# Altium schematic sheet projet_pcb_nucleo_g431.SchDoc
size A2
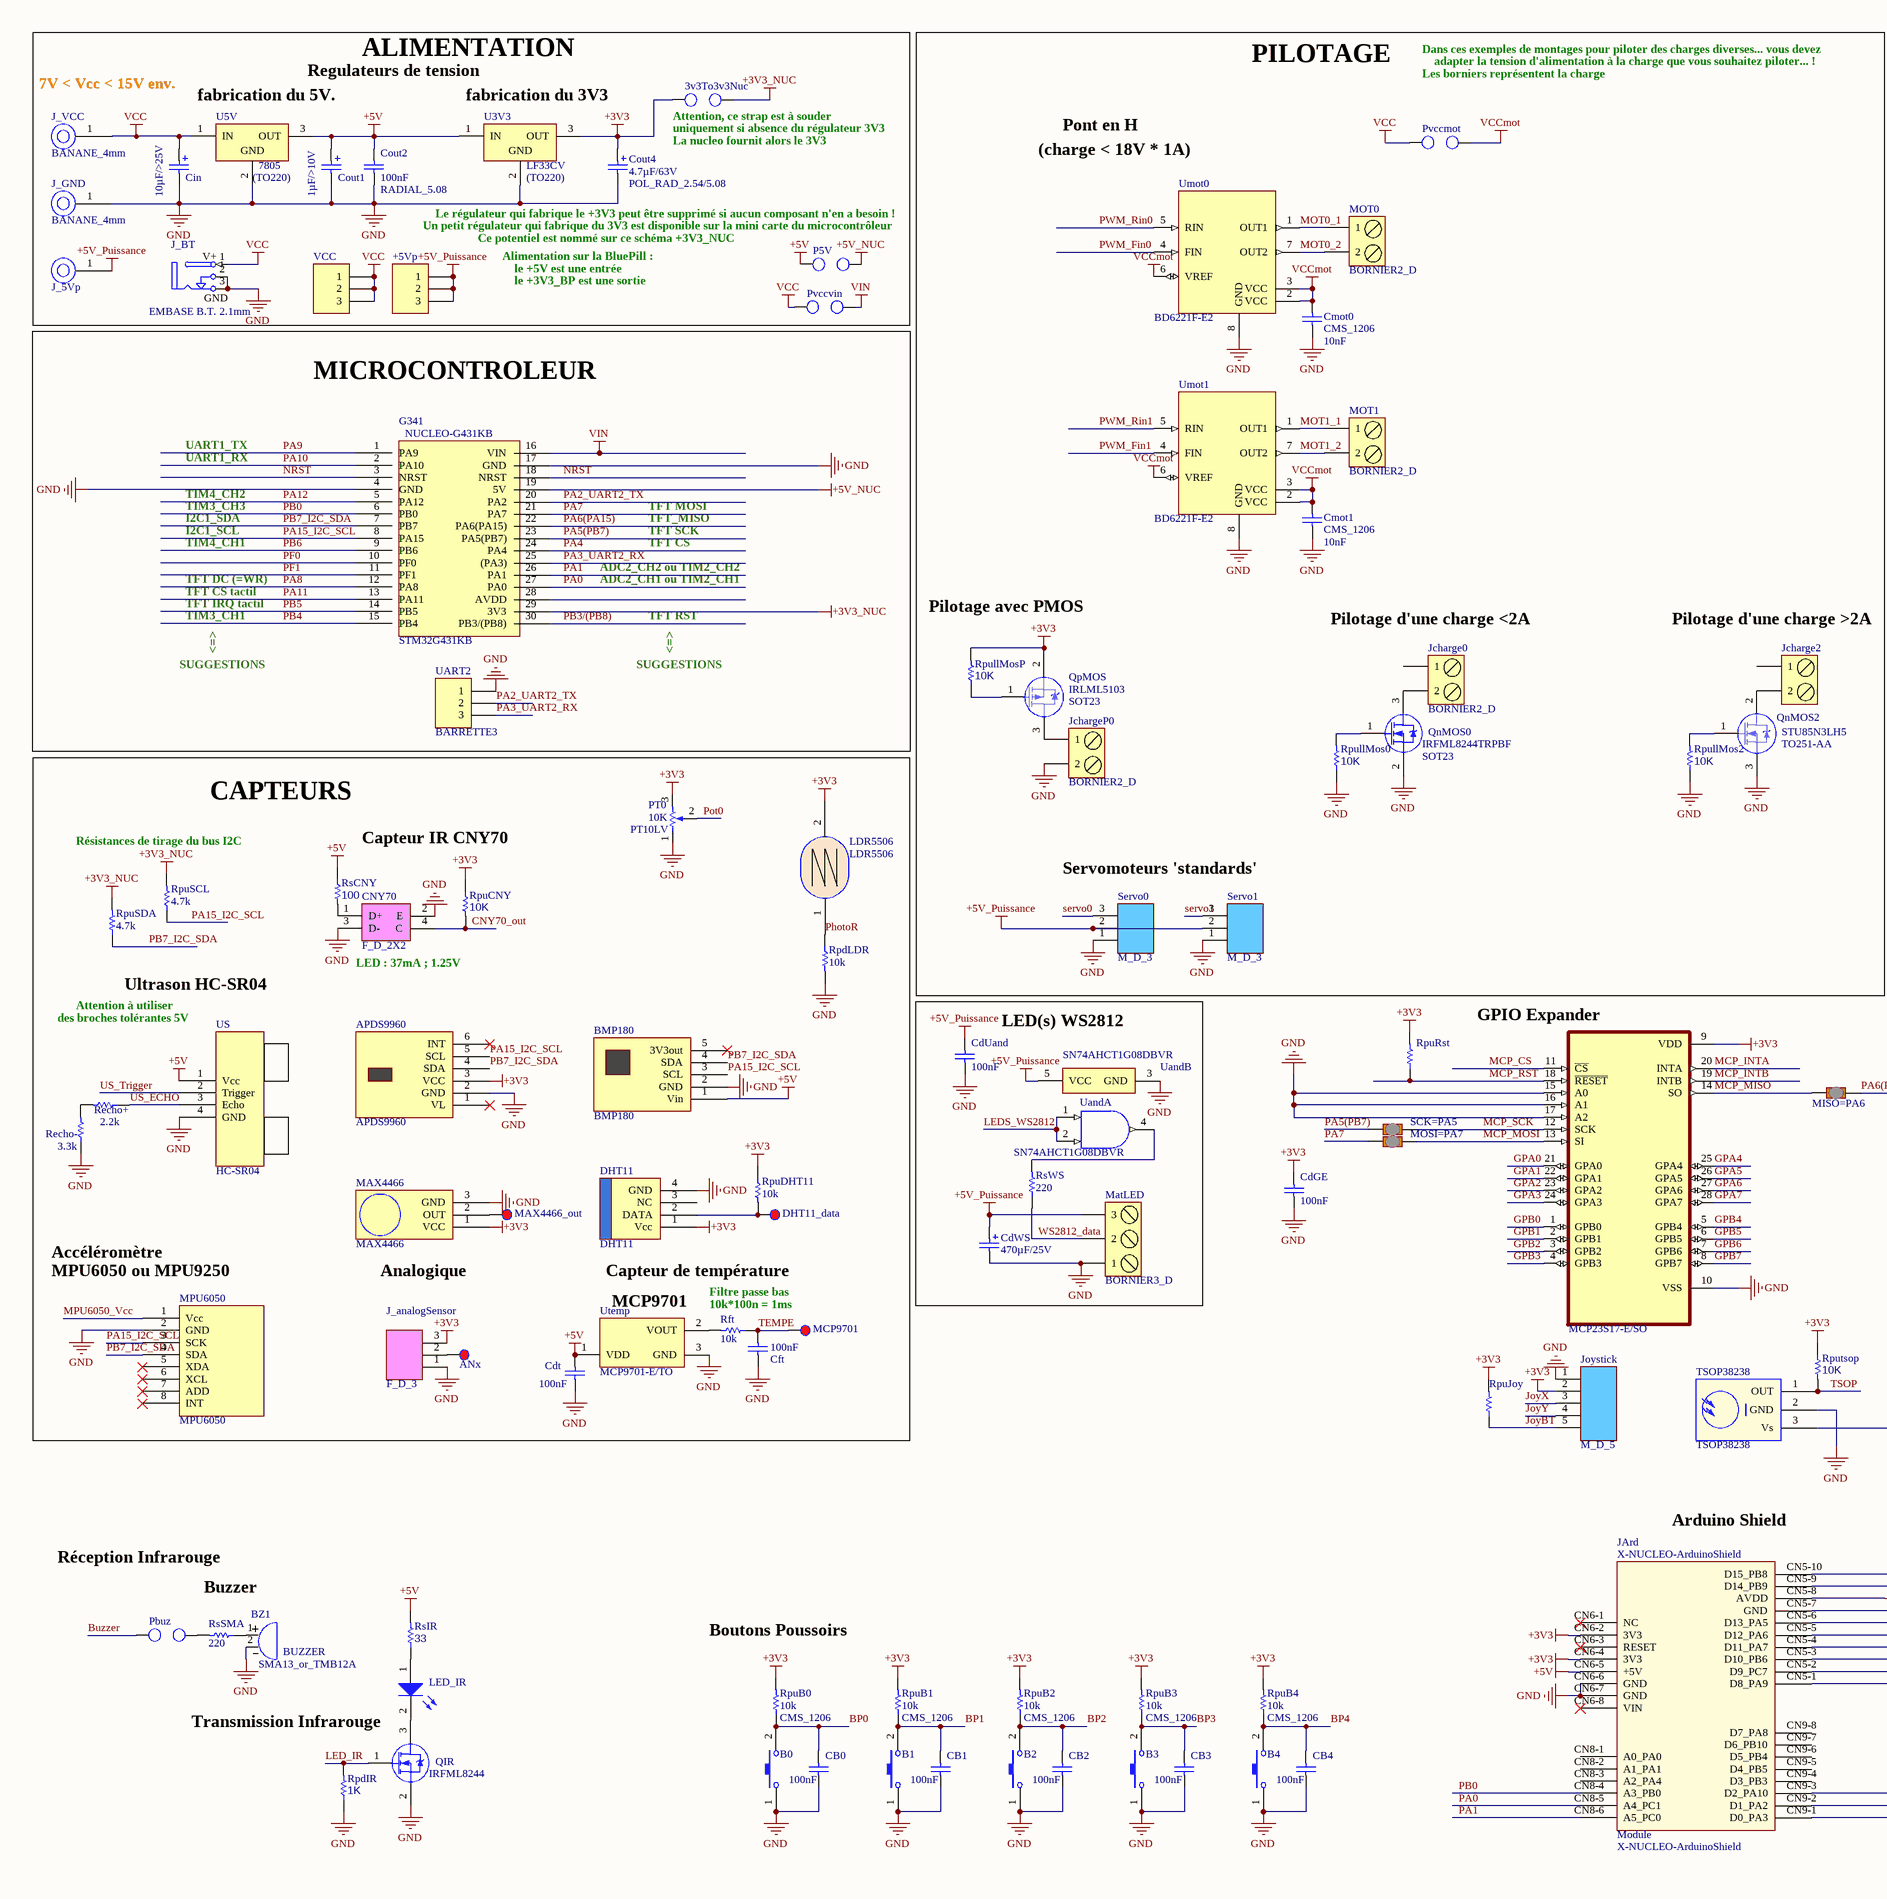
[diagram p0: projet_pcb_nucleo_g431.SchDoc, left]
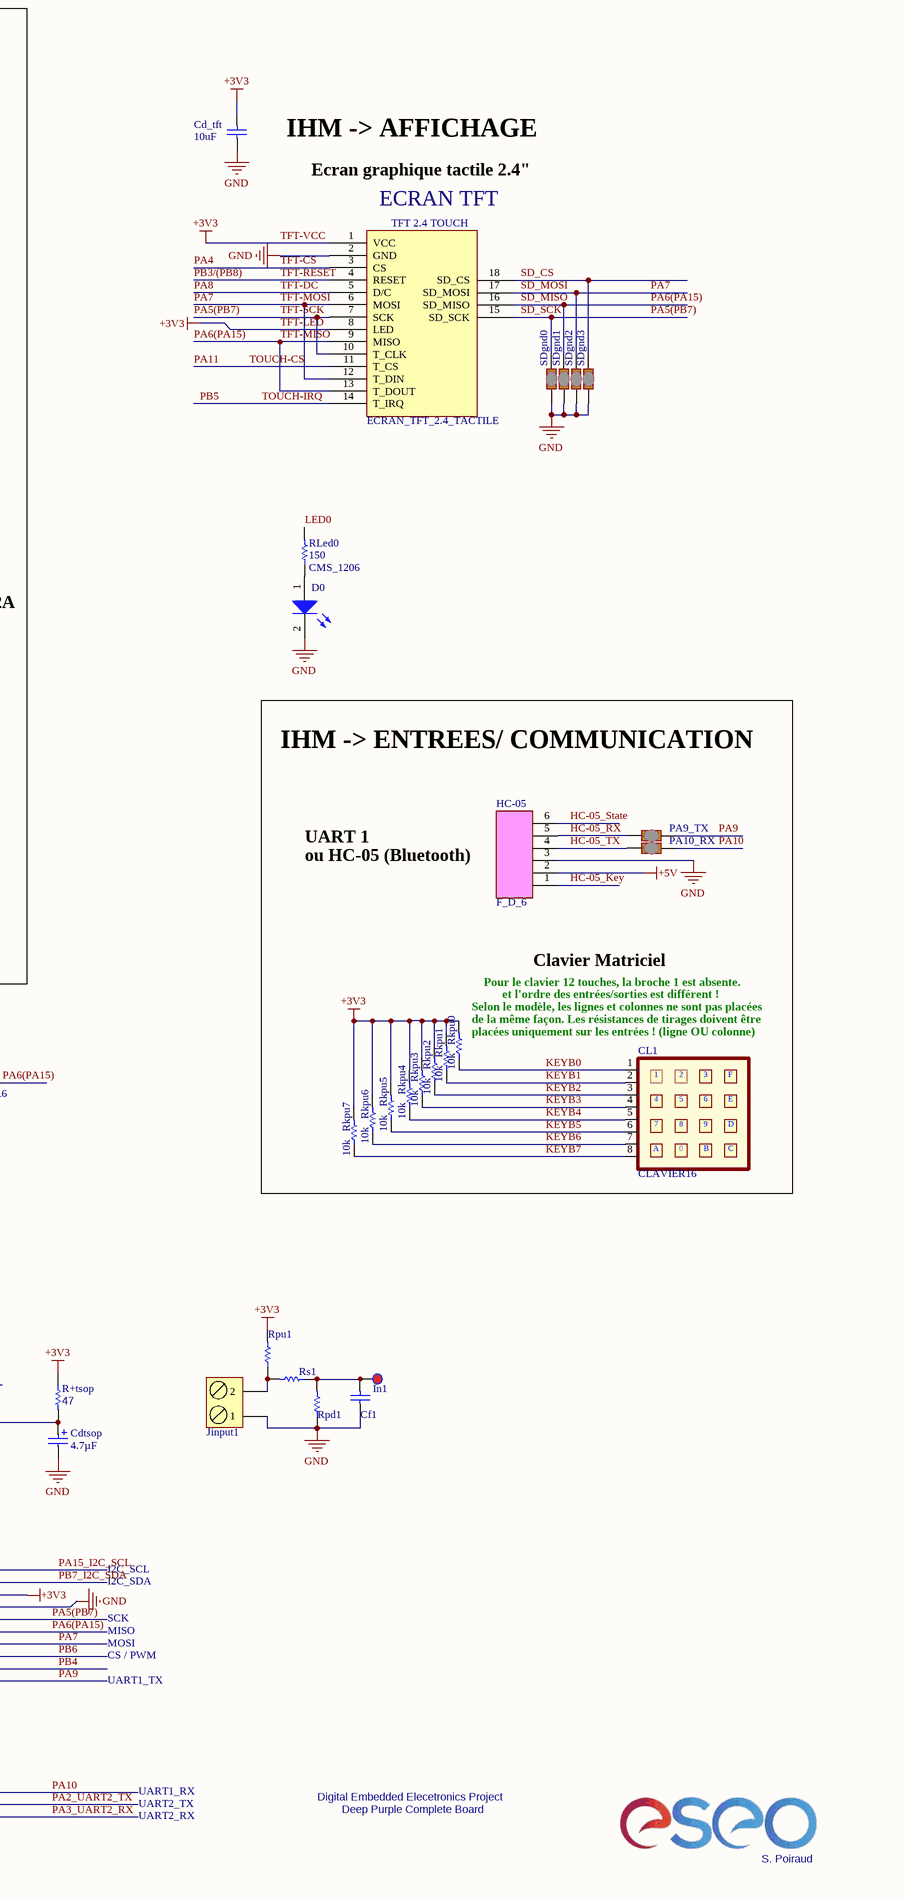
[diagram p1: projet_pcb_nucleo_g431.SchDoc, right]

## Parts
3v3To3v3Nuc  JUMPER2  [BARRETTE_2_M_D]  (value not drawn)
+5Vp  BARRETTE3  [HDR1X3]  (value not drawn)
?  MCP23S17-E/SO  [SOIC127P1030X265-28N]
ANx  Name  [Point_Fil]  (value not drawn)
APDS9960  APDS9960  [APDS9960]
B0  BOUTON_POUSSOIR_MINIATURE_TRAVERSANT  [BOUTON_POUSSE_PLAT_6x6]  (value not drawn)
B1  BOUTON_POUSSOIR_MINIATURE_TRAVERSANT  [BOUTON_POUSSE_PLAT_6x6]  (value not drawn)
B2  BOUTON_POUSSOIR_MINIATURE_TRAVERSANT  [BOUTON_POUSSE_PLAT_6x6]  (value not drawn)
B3  BOUTON_POUSSOIR_MINIATURE_TRAVERSANT  [BOUTON_POUSSE_PLAT_6x6]  (value not drawn)
B4  BOUTON_POUSSOIR_MINIATURE_TRAVERSANT  [BOUTON_POUSSE_PLAT_6x6]  (value not drawn)
BMP180  BMP180  [BMP180]
BZ1  value SMA13_or_TMB12A  Type: BUZZER  [BUZZER_SMA13  or TMB12A]  (hidden comment: BUZZER_SMA13)
CB0  value 100nF  [C0805_N]  (hidden comment: Condensateur 0805)
CB1  value 100nF  [C0805_N]  (hidden comment: Condensateur 0805)
CB2  value 100nF  [C0805_N]  (hidden comment: Condensateur 0805)
CB3  value 100nF  [C0805_N]  (hidden comment: Condensateur 0805)
CB4  value 100nF  [C0805_N]  (hidden comment: Condensateur 0805)
Cd_tft  10uF  [C0805_N]
CdGE  value 100nF  [C0805_N]  (hidden comment: CONDENSATEUR_CER_RAD_5.08)
Cdt  value 100nF  [C0805_N]  (hidden comment: Condensateur CMS 0805)
Cdtsop  value 4.7µF  [CONDENSATEUR_POLARISE_ELECTROLYTIQUE_RADIAL_2.0/5.08]  (hidden comment: CONDENSATEUR_POL_ELECTROLY_RAD_2.0/5.08)
CdUand  value 100nF  [C0805_N]  (hidden comment: CONDENSATEUR_CER_RAD_5.08)
CdWS  value 470µF/25V  [CONDENSATEUR_POLARISE_ELECTROLYTIQUE_RADIAL_5.08/10.16]  (hidden comment: CONDENSATEUR_POL_ELECTROLY_RAD_5.08/10.16)
Cf1  Condensateur 0805  [C0805_N]  (value not drawn)
Cft  value 100nF  [C0805_N]  (hidden comment: Condensateur CMS 0805)
Cin  value 10µF/>25V  [CONDENSATEUR_POLARISE_ELECTROLYTIQUE_RADIAL_2.0/5.08]  (hidden comment: CONDENSATEUR_POL_ELECTROLY_RAD_2.0/5.08)
CL1  Type: CLAVIER16  [CLAVIER_16_TOUCHES]  (hidden comment: CLAVIER_16_TOUCHES)
Cmot0  value 10nF  [CONDENSATEUR_CMS_1206]  (hidden comment: CMS_1206)
Cmot1  value 10nF  [CONDENSATEUR_CMS_1206]  (hidden comment: CMS_1206)
CNY70  Type: F_D_2X2  [BARRETTE_2X2_F_D]  (hidden comment: BARRETTE 2 CONTACTS 2 RANGEES FEMELLE DROITE)
Cout1  value 1µF/>10V  [CONDENSATEUR_POLARISE_ELECTROLYTIQUE_RADIAL_2.0/5.08]  (hidden comment: CONDENSATEUR_POL_ELECTROLY_RAD_2.0/5.08)
Cout2  value 100nF  Type: RADIAL_5.08  [CONDENSATEUR_CERAMIQUE_RADIAL_5.08]  (hidden comment: CONDENSATEUR_CER_RAD_5.08)
Cout4  value 4.7µF/63V  Type: POL_RAD_2.54/5.08  [CONDENSATEUR_POLARISE_ELECTROLYTIQUE_RADIAL_2.54/5.08]  (hidden comment: CONDENSATEUR_POL_ELECTROLY_RAD_2.54/5.08)
D  Type: LED_IR  [LED_5MM]  (hidden comment: LED_3MM)
D0  LED_3MM  [LED_3MM]  (value not drawn)
DHT11  DHT11  [DHT11]
DHT11_data  Name  [Point_Fil]  (value not drawn)
G341  STM32G431KB  [NUCLEO-G431KB]
HC-05  Type: F_D_6  [BARRETTE_6_F_D]  (hidden comment: BARRETTE_6 CONTACTS_1 RANGEE_FEMELLE_DROITE)
In1  Name  [Point_Fil]  (value not drawn)
J_5Vp  DOUILLE BANANE 4mm  [DOUILLE_BANANE_4mm]  (value not drawn)
J_analogSensor  Type: F_D_3  [BARRETTE_3_F_D]  (hidden comment: BARRETTE 3 CONTACTS 1 RANGEE FEMELLE DROITE)
J_BT  Type: EMBASE B.T. 2.1mm  [EMBASE_BASSE_TENSION_2.1mm]  (hidden comment: EMBASE_BASSE_TENSION_2.1mm)
J_GND  Type: BANANE_4mm  [DOUILLE_BANANE_4mm]  (hidden comment: DOUILLE BANANE 4mm)
J_VCC  Type: BANANE_4mm  [DOUILLE_BANANE_4mm]  (hidden comment: DOUILLE BANANE 4mm)
JArd  X-NUCLEO-ArduinoShield  [X-NUCLEO-ARDUINO_SHIELD]
Jcharge0  Type: BORNIER2_D  [BORNIER2_A_VIS]  (hidden comment: BORNIER2 DROIT A VIS)
Jcharge2  BORNIER2 DROIT A VIS  [BORNIER2_A_VIS]  (value not drawn)
JchargeP0  Type: BORNIER2_D  [BORNIER2_A_VIS]  (hidden comment: BORNIER2 DROIT A VIS)
Jinput1  BORNIER2 DROIT A VIS  [BORNIER2_A_VIS]  (value not drawn)
Joystick  Type: M_D_5  [BARRETTE_5_M_D]  (hidden comment: BARRETTE_5 CONTACTS_1 RANGEE_MALE_DROITE)
LDR5506  LDR5506  [LDR5506]
MatLED  Type: BORNIER3_D  [BORNIER3_A_VIS]  (hidden comment: BORNIER3 DROIT A VIS)
MAX4466  MAX4466  [MAX4466]
MAX4466_out  Name  [Point_Fil]  (value not drawn)
MCP9701  Name  [Point_Fil]  (value not drawn)
MISO=PA6  Goutte Strap  [GOUTTE_Starp]  (value not drawn)
MOSI=PA7  Goutte Strap  [GOUTTE_Starp]  (value not drawn)
MOT0  Type: BORNIER2_D  [BORNIER2_A_VIS]  (hidden comment: BORNIER2 DROIT A VIS)
MOT1  Type: BORNIER2_D  [BORNIER2_A_VIS]  (hidden comment: BORNIER2 DROIT A VIS)
MPU6050  MPU6050  [MPU6050]
P5V  JUMPER2  [BARRETTE_2_M_D]  (value not drawn)
PA9_TX  Goutte Strap  [GOUTTE_Starp]  (value not drawn)
PA10_RX  Goutte Strap  [GOUTTE_Starp]  (value not drawn)
Pbuz  JUMPER2  [BARRETTE_2_M_D]  (value not drawn)
PT0  value 10K  Type: PT10LV  [TRIMMER_MONOTOUR_PT10LV]  (hidden comment: RESISTANCE_VARIABLE_TRAVERSANTE : PT10LV)
Pvccmot  JUMPER2  [BARRETTE_2_M_D]  (value not drawn)
Pvccvin  JUMPER2  [BARRETTE_2_M_D]  (value not drawn)
QIR  Type: IRFML8244  [TRANSISTOR_MOSFET-N_SOT23_GSD]  (hidden comment: TRANSISTOR_MOSFET-N_SOT23_GSD)
QnMOS0  Type: IRFML8244TRPBF  Package: SOT23  [TRANSISTOR_MOSFET-N_SOT23_GSD]  (hidden comment: TRANSISTOR_MOSFET-N_SOT23_GSD)
QnMOS2  Package: TO251-AA  [TRANSISTOR_MOSFET-N_TO251AB_GDS+TO220]  (hidden comment: TRANSISTOR_MOSFET-N_TO220_GDS)
QpMOS  Package: SOT23  Type: IRLML5103  [TRANSISTOR_MOSFET-P_SOT23_GSD]  (hidden comment: TRANSISTOR_MOSFET-P_SOT23_GSD)
R+tsop  value 47  [RESISTANCE_CMS_1206]  (hidden comment: RESISTANCE_CMS_1206)
Recho+  2.2k  [R1206_N]
Recho-  3.3k  [R1206_N]
Rft  10k  [R1206_N]
Rkpu0  value 10k  [RESISTANCE_CMS_1206]  (hidden comment: RESISTANCE_CMS_1206)
Rkpu1  value 10k  [RESISTANCE_CMS_1206]  (hidden comment: RESISTANCE_CMS_1206)
Rkpu2  value 10k  [RESISTANCE_CMS_1206]  (hidden comment: RESISTANCE_CMS_1206)
Rkpu3  value 10k  [RESISTANCE_CMS_1206]  (hidden comment: RESISTANCE_CMS_1206)
Rkpu4  value 10k  [RESISTANCE_CMS_1206]  (hidden comment: RESISTANCE_CMS_1206)
Rkpu5  value 10k  [RESISTANCE_CMS_1206]  (hidden comment: RESISTANCE_CMS_1206)
Rkpu6  value 10k  [RESISTANCE_CMS_1206]  (hidden comment: RESISTANCE_CMS_1206)
Rkpu7  value 10k  [RESISTANCE_CMS_1206]  (hidden comment: RESISTANCE_CMS_1206)
RLed0  value 150  Type: CMS_1206  [RESISTANCE_CMS_1206]  (hidden comment: RESISTANCE_CMS_1206)
Rpd1  RESISTANCE_CMS_1206  [RESISTANCE_CMS_1206]  (value not drawn)
RpdIR  value 1K  [RESISTANCE_CMS_1206]  (hidden comment: RESISTANCE_CMS_1206)
RpdLDR  10k  [R1206_N]
Rpu1  RESISTANCE_CMS_1206  [RESISTANCE_CMS_1206]  (value not drawn)
RpuB0  value 10k  Type: CMS_1206  [RESISTANCE_CMS_1206]  (hidden comment: RESISTANCE_CMS_1206)
RpuB1  value 10k  Type: CMS_1206  [RESISTANCE_CMS_1206]  (hidden comment: RESISTANCE_CMS_1206)
RpuB2  value 10k  Type: CMS_1206  [RESISTANCE_CMS_1206]  (hidden comment: RESISTANCE_CMS_1206)
RpuB3  value 10k  Type: CMS_1206  [RESISTANCE_CMS_1206]  (hidden comment: RESISTANCE_CMS_1206)
RpuB4  value 10k  Type: CMS_1206  [RESISTANCE_CMS_1206]  (hidden comment: RESISTANCE_CMS_1206)
RpuCNY  value 10K  [RESISTANCE_CMS_1206]  (hidden comment: RESISTANCE CMS 1206)
RpuDHT11  10k  [R1206_N]
RpuJoy  RESISTANCE_CMS_1206  [RESISTANCE_CMS_1206]  (value not drawn)
RpullMos0  value 10K  [R1206_N]  (hidden comment: RESISTANCE_AXIALE_1/4W)
RpullMos2  value 10K  [R1206_N]  (hidden comment: RESISTANCE_AXIALE_1/4W)
RpullMosP  value 10K  [R1206_N]  (hidden comment: RESISTANCE_AXIALE_1/4W)
RpuRst  RESISTANCE_CMS_1206  [RESISTANCE_CMS_1206]  (value not drawn)
RpuSCL  value 4.7k  [R1206_N]  (hidden comment: RESISTANCE_CMS_1206)
RpuSDA  value 4.7k  [R1206_N]  (hidden comment: RESISTANCE_CMS_1206)
Rputsop  value 10K  [RESISTANCE_CMS_1206]  (hidden comment: RESISTANCE_CMS_1206)
Rs1  RESISTANCE_CMS_1206  [RESISTANCE_CMS_1206]  (value not drawn)
RsCNY  value 100  [RESISTANCE_CMS_1206]  (hidden comment: RESISTANCE CMS 1206)
RsIR  value 33  [RESISTANCE_CMS_1206]  (hidden comment: RESISTANCE_CMS_1206)
RsSMA  value 220  [R1206_N]  (hidden comment: RESISTANCE_CMS_1206)
RsWS  value 220  [R1206_N]  (hidden comment: RESISTANCE_CMS_1206)
SCK=PA5  Goutte Strap  [GOUTTE_Starp]  (value not drawn)
SDgnd0  Goutte Strap  [GOUTTE_Starp]  (value not drawn)
SDgnd1  Goutte Strap  [GOUTTE_Starp]  (value not drawn)
SDgnd2  Goutte Strap  [GOUTTE_Starp]  (value not drawn)
SDgnd3  Goutte Strap  [GOUTTE_Starp]  (value not drawn)
Servo0  Type: M_D_3  [BARRETTE_3_M_D]  (hidden comment: BARRETTE 3 CONTACTS 1 RANGEE MALE DROITE)
Servo1  Type: M_D_3  [BARRETTE_3_M_D]  (hidden comment: BARRETTE 3 CONTACTS 1 RANGEE MALE DROITE)
TFT1  ECRAN_TFT_2.4_TACTILE  [ECRAN_TFT_2.4_TACTILE]
TSOP38238  TSOP38238  [tsop38238]
U3V3  Type: LF33CV  Package: (TO220)  [REGULATEUR_TO220_78XX]  (hidden comment: REGULATEUR_TO220_78XX)
U5V  Type: 7805  Package: (TO220)  [REGULATEUR_TO220_78XX]  (hidden comment: REGULATEUR_TO220_78XX)
Uand  SN74AHCT1G08DBVR  [DBV0005A_N]  (parts A,B of 2)
UART2  BARRETTE3  [HDR1X3]
Umot0  BD6221F-E2  [SOIC8_PAS=1.27_LARG=4_LONG=5]
Umot1  BD6221F-E2  [SOIC8_PAS=1.27_LARG=4_LONG=5]
US  HC-SR04  [HC-SR04]
Utemp  Type: MCP9701-E/TO  [COMPOSANT_TO92]  (hidden comment: CAPTEUR_TEMPERATURE_MCP9701-E/TO)
VCC  BARRETTE3  [HDR1X3]  (value not drawn)

## Blocks framed on the sheet
ALIMENTATION: 3v3To3v3Nuc +5Vp Cin Cout1 Cout2 Cout4 J_5Vp J_BT J_GND J_VCC P5V Pvccvin U3V3 U5V VCC
PILOTAGE: Cmot0 Cmot1 Jcharge0 Jcharge2 JchargeP0 MOT0 MOT1 Pvccmot QnMOS0 QnMOS2 QpMOS RpullMos0 RpullMos2 RpullMosP Servo0 Servo1 Umot0 Umot1
MICROCONTROLEUR: G341 UART2
CAPTEURS: ANx APDS9960 BMP180 Cdt Cft CNY70 DHT11 DHT11_data J_analogSensor LDR5506 MAX4466 MAX4466_out MCP9701 MPU6050 PT0 Recho+ Recho- Rft RpdLDR RpuCNY RpuDHT11 RpuSCL RpuSDA RsCNY US Utemp
IHM -> ENTREES/ COMMUNICATION: CL1 HC-05 PA9_TX PA10_RX Rkpu0-Rkpu7
LED(s) WS2812: CdUand CdWS MatLED RsWS Uand

## Nets
+3V3_NUC: 3v3To3v3Nuc.2 G341.29(3V3) RpuSCL.2 RpuSDA.2
+5V: BMP180.1(Vin) Cdt.1 Cout1.1 Cout2.2 HC-05.2 JArd.CN6-5(+5V) P5V.1 RsCNY.1 RsIR.2 U3V3.1(IN) U5V.3(OUT) US.1(Vcc) Utemp.1(VDD)
+5V_NUC: G341.19(5V) P5V.2
+5V_Puissance: +5Vp.1 +5Vp.2 +5Vp.3 CdUand.2 CdWS.1 J_5Vp.1 MatLED.3 Servo0.2 Servo1.2 Uand.5(VCC)
GND: ?.10(VSS) ?.15(A0) ?.16(A1) ?.17(A2) APDS9960.2(GND) B0.1 B1.1 B2.1 B3.1 B4.1 BMP180.2(GND) BZ1.2 CB0.1 CB1.1 CB2.1 CB3.1 CB4.1 Cd_tft.1 CdGE.1 Cdt.2 Cdtsop.2 CdUand.1 CdWS.2 Cf1.1 Cft.2 Cin.2 Cmot0.1 Cmot1.1 CNY70.2(E) CNY70.3(D-) Cout1.2 Cout2.1 Cout4.2 D0.2 DHT11.4(GND) G341.4(GND) G341.17(GND) HC-05.3 J_analogSensor.1 J_BT.2 J_BT.3 J_GND.1 JArd.CN5-7(GND) JArd.CN6-6(GND) JArd.CN6-7(GND) JchargeP0.2 Jinput1.1 Joystick.1 MatLED.1 MAX4466.3(GND) MPU6050.2(GND) PT0.1 QIR.2(S) QnMOS0.2(S) QnMOS2.3(S) Recho-.1 Rpd1.1 RpdIR.1 RpdLDR.2 RpullMos0.1 RpullMos2.1 SDgnd0.1 SDgnd1.1 SDgnd2.1 SDgnd3.1 Servo0.1 Servo1.1 TFT1.2(GND) TSOP38238.2(GND) U3V3.2(GND) U5V.2(GND) Uand.3(GND) UART2.1 Umot0.8(GND) Umot1.8(GND) US.4(GND) Utemp.3(GND)
TFT-LED: 3v3To3v3Nuc.1 ?.9(VDD) APDS9960.3(VCC) Cd_tft.2 CdGE.2 Cout4.1 DHT11.1(Vcc) J_analogSensor.3 JArd.CN5-8(AVDD) JArd.CN6-2(3V3) JArd.CN6-4(3V3) Joystick.2 LDR5506.2 MAX4466.1(VCC) PT0.3 QpMOS.2(S) R+tsop.1 Rkpu0.2 Rkpu1.2 Rkpu2.2 Rkpu3.2 Rkpu4.2 Rkpu5.2 Rkpu6.2 Rkpu7.2 Rpu1.2 RpuB0.2 RpuB1.2 RpuB2.2 RpuB3.2 RpuB4.2 RpuCNY.1 RpuDHT11.1 RpuJoy.2 RpullMosP.2 RpuRst.2 Rputsop.1 TFT1.1(VCC) TFT1.8(LED) U3V3.3(OUT)  [also labelled +3V3, TFT-VCC]
VCC: Cin.1 J_BT.1 J_VCC.1 Pvccmot.1 Pvccvin.1 U5V.1(IN) VCC.1 VCC.2 VCC.3
VCCmot: Cmot0.2 Cmot1.2 Pvccmot.2 Umot0.2(VCC) Umot0.3(VCC) Umot0.6(VREF) Umot1.2(VCC) Umot1.3(VCC) Umot1.6(VREF)
VIN: G341.16(VIN) Pvccvin.2
BP0: B0.2 CB0.2 RpuB0.1
BP1: B1.2 CB1.2 RpuB1.1
BP2: B2.2 CB2.2 RpuB2.1
BP3: B3.2 CB3.2 RpuB3.1
BP4: B4.2 CB4.2 RpuB4.1
Buzzer: Pbuz.1
CNY70_out: CNY70.4(C) RpuCNY.2
GPA0: ?.21(GPA0)
GPA1: ?.22(GPA1)
GPA2: ?.23(GPA2)
GPA3: ?.24(GPA3)
GPA4: ?.25(GPA4)
GPA5: ?.26(GPA5)
GPA6: ?.27(GPA6)
GPA7: ?.28(GPA7)
GPB0: ?.1(GPB0)
GPB1: ?.2(GPB1)
GPB2: ?.3(GPB2)
GPB3: ?.4(GPB3)
GPB4: ?.5(GPB4)
GPB5: ?.6(GPB5)
GPB6: ?.7(GPB6)
GPB7: ?.8(GPB7)
HC-05_Key: HC-05.1
HC-05_RX: HC-05.5 PA9_TX.1
HC-05_State: HC-05.6
HC-05_TX: HC-05.4 PA10_RX.1
JoyBT: Joystick.5 RpuJoy.1
JoyX: Joystick.3
JoyY: Joystick.4
KEYB0: CL1.1 Rkpu0.1
KEYB1: CL1.2 Rkpu1.1
KEYB2: CL1.3 Rkpu2.1
KEYB3: CL1.4 Rkpu3.1
KEYB4: CL1.5 Rkpu4.1
KEYB5: CL1.6 Rkpu5.1
KEYB6: CL1.7 Rkpu6.1
KEYB7: CL1.8 Rkpu7.1
LED0: RLed0.2
LED_IR: QIR.1(G) RpdIR.2
LEDS_WS2812: Uand.1(A) Uand.2(B)
MCP_CS: ?.11(~{CS})
MCP_INTA: ?.20(INTA)
MCP_INTB: ?.19(INTB)
MCP_MISO: ?.14(SO) MISO=PA6.1
MCP_MOSI: ?.13(SI) MOSI=PA7.2
MCP_RST: ?.18(~{RESET}) RpuRst.1
MCP_SCK: ?.12(SCK) SCK=PA5.2
MOT0_1: MOT0.1 Umot0.1(OUT1)
MOT0_2: MOT0.2 Umot0.7(OUT2)
MOT1_1: MOT1.1 Umot1.1(OUT1)
MOT1_2: MOT1.2 Umot1.7(OUT2)
MPU6050_Vcc: MPU6050.1(Vcc)
NRST: G341.3(NRST) G341.18(NRST)
PA0: G341.27(PA0) JArd.CN8-5(A4_PC1)
PA1: G341.26(PA1) JArd.CN8-6(A5_PC0)
PA2_UART2_TX: G341.20(PA2) JArd.CN9-2(D1_PA2) UART2.2
PA3_UART2_RX: G341.25((PA3)) JArd.CN9-1(D0_PA3) UART2.3
PA4: G341.24(PA4) TFT1.3(CS)  [also labelled TFT-CS]
PA5(PB7): G341.23(PA5(PB7)) JArd.CN5-6(D13_PA5) SCK=PA5.1 SDgnd0.2 TFT1.7(SCK) TFT1.10(T_CLK) TFT1.15(SD_SCK)  [also labelled SD_SCK, TFT-SCK]
PA6(PA15): G341.22(PA6(PA15)) JArd.CN5-5(D12_PA6) MISO=PA6.2 SDgnd1.2 TFT1.9(MISO) TFT1.13(T_DOUT) TFT1.16(SD_MISO)  [also labelled SD_MISO, TFT-MISO]
PA7: G341.21(PA7) JArd.CN5-4(D11_PA7) MOSI=PA7.1 SDgnd2.2 TFT1.6(MOSI) TFT1.12(T_DIN) TFT1.17(SD_MOSI)  [also labelled SD_MOSI, TFT-MOSI]
PA8: G341.12(PA8) TFT1.5(D/C)  [also labelled TFT-DC]
PA9: G341.1(PA9) JArd.CN5-1(D8_PA9) PA9_TX.2
PA10: G341.2(PA10) JArd.CN9-3(D2_PA10) PA10_RX.2
PA11: G341.13(PA11) TFT1.11(T_CS)  [also labelled TOUCH-CS]
PA12: G341.5(PA12)
PA15_I2C_SCL: APDS9960.5(SCL) BMP180.3(SCL) G341.8(PA15) JArd.CN5-10(D15_PB8) MPU6050.3(SCK) RpuSCL.1
PB0: G341.6(PB0) JArd.CN8-4(A3_PB0)
PB3/(PB8): G341.30(PB3/(PB8)) TFT1.4(RESET)  [also labelled TFT-RESET]
PB4: G341.15(PB4) JArd.CN5-2(D9_PC7)
PB5: G341.14(PB5) TFT1.14(T_IRQ)  [also labelled TOUCH-IRQ]
PB6: G341.9(PB6) JArd.CN5-3(D10_PB6)
PB7_I2C_SDA: APDS9960.4(SDA) BMP180.4(SDA) G341.7(PB7) JArd.CN5-9(D14_PB9) MPU6050.4(SDA) RpuSDA.1
PF0: G341.10(PF0)
PF1: G341.11(PF1)
PhotoR: LDR5506.1 RpdLDR.1
Pot0: PT0.2
PWM_Fin0: Umot0.4(FIN)
PWM_Fin1: Umot1.4(FIN)
PWM_Rin0: Umot0.5(RIN)
PWM_Rin1: Umot1.5(RIN)
SD_CS: SDgnd3.2 TFT1.18(SD_CS)
servo0: Servo0.3
servo1: Servo1.3
TEMPE: Cft.1 MCP9701.1 Rft.1
TSOP: Rputsop.2 TSOP38238.1(OUT)
US_ECHO: Recho+.1 US.3(Echo)
US_Trigger: US.2(Trigger)
WS2812_data: MatLED.2 RsWS.1
NetANx_1: ANx.1 J_analogSensor.2
NetBZ1_1: BZ1.1 RsSMA.1
NetCdtsop_1: Cdtsop.1 R+tsop.2 TSOP38238.3(Vs)
NetCf1_2: Cf1.2 In1.1 Rpd1.2 Rs1.1
NetCNY70_1: CNY70.1(D+) RsCNY.2
NetD0_1: D0.1 RLed0.1
NetD_1: D.1 RsIR.1
NetD_2: D.2 QIR.3(D)
NetDHT11_2: DHT11.2(DATA) DHT11_data.1 RpuDHT11.2
NetJcharge0_2: Jcharge0.2 QnMOS0.3(D)
NetJcharge2_2: Jcharge2.2 QnMOS2.2(D)
NetJchargeP0_1: JchargeP0.1 QpMOS.3(D)
NetJinput1_2: Jinput1.2 Rpu1.1 Rs1.2
NetMAX4466_2: MAX4466.2(OUT) MAX4466_out.1
NetPbuz_2: Pbuz.2 RsSMA.2
NetQnMOS0_1: QnMOS0.1(G) RpullMos0.2
NetQnMOS2_1: QnMOS2.1(G) RpullMos2.2
NetQpMOS_1: QpMOS.1(G) RpullMosP.1
NetRecho+_2: Recho+.2 Recho-.2
NetRft_2: Rft.2 Utemp.2(VOUT)
NetRsWS_2: RsWS.2 Uand.4(Y)

Not connected (* = marked no-connect by the designer): APDS9960 1(VL)* 6(INT)*; BMP180 5(3V3out)*; DHT11 3(NC); G341 28(AVDD); JArd CN6-1(NC)* CN6-3(RESET)* CN6-8(VIN)* CN8-1(A0_PA0) CN8-2(A1_PA1) CN8-3(A2_PA4) CN9-4(D3_PB3) CN9-5(D4_PB5) CN9-6(D5_PB4) CN9-7(D6_PB10) CN9-8(D7_PA8); Jcharge0 1; Jcharge2 1; MPU6050 5(XDA)* 6(XCL)* 7(ADD)* 8(INT)*

## Notes on the sheet
- 7V < Vcc < 15V env.
- (near U5V) fabrication du 5V.
- Regulateurs de tension
- (near U3V3) fabrication du 3V3
- Dans ces exemples de montages pour piloter des charges diverses... vous devez
- Les borniers représentent la charge
- adapter la tension d'alimentation à la charge que vous souhaitez piloter... !
- (near 3v3To3v3Nuc) Attention, ce strap est à souder
- (near 3v3To3v3Nuc) uniquement si absence du régulateur 3V3
- La nucleo fournit alors le 3V3
- (charge < 18V * 1A)
- Pont en H
- Le régulateur qui fabrique le +3V3 peut être supprimé si aucun composant n'en a besoin !
- IHM -> AFFICHAGE
- Ecran graphique tactile 2.4"
- Un petit régulateur qui fabrique du 3V3 est disponible sur la mini carte du microcontrôleur
- Ce potentiel est nommé sur ce schéma +3V3_NUC
- Alimentation sur la BluePill :
- le +5V est une entrée
- (near TFT1) ECRAN TFT
- le +3V3_BP est une sortie
- UART1_TX
- UART1_RX
- TIM4_CH2
- TIM3_CH3
- I2C1_SDA
- TFT_MISO
- TFT MOSI
- TFT DC (=WR)
- TIM4_CH1
- I2C1_SCL
- ADC2_CH2 ou TIM2_CH2
- ADC2_CH1 ou TIM2_CH1
- TFT CS
- TFT SCK
- TFT CS tactil
- TFT IRQ tactil
- TIM3_CH1
- TFT RST
- Pilotage avec PMOS
- (near Jcharge0) Pilotage d'une charge <2A
- (near Jcharge2) Pilotage d'une charge >2A
- SUGGESTIONS
- <=>
- STU85N3LH5
- (near RpuSCL) Résistances de tirage du bus I2C
- Capteur IR CNY70
- Servomoteurs 'standards'
- UART 1
- ou HC-05 (Bluetooth)
- Attention à utiliser
- Ultrason HC-SR04
- LED : 37mA ; 1.25V
- Pour le clavier 12 touches, la broche 1 est absente.
- et l'ordre des entrées/sorties est différent !
- Clavier Matriciel
- des broches tolérantes 5V
- GPIO Expander
- (near Rkpu0) Selon le modèle, les lignes et colonnes ne sont pas placées
- (near Rkpu0) de la même façon. Les résistances de tirages doivent être
- (near Rkpu0) placées uniquement sur les entrées ! (ligne OU colonne)
- Accéléromètre
- (near MPU6050) MPU6050 ou MPU9250
- (near MAX4466) Analogique
- Capteur de température
- (near Utemp) MCP9701
- 10k*100n = 1ms
- Filtre passe bas
- Réception Infrarouge
- (near JArd) Arduino Shield
- Buzzer
- I2C_SCL
- I2C_SDA
- Boutons Poussoirs
- SCK
- MISO
- MOSI
- CS / PWM
- (near QIR) Transmission Infrarouge
- UART2_TX
- Digital Embedded Elecetronics Project
- UART2_RX
- Deep Purple Complete Board
- S. Poiraud
- Title
- Size:
- Date:
- File:
- A2
- Number:
- Time:
- Revision:
- Sheet
- of
- (in symbol CLAVIER_16_TOUCHES) F; E; 9; D; A; 0; B; C
- (in symbol ECRAN_TFT_2.4_TACTILE) TFT 2.4 TOUCH
- (in symbol EMBASE_BASSE_TENSION_2.1mm) V+; GND
- (in symbol G431_Nucleo) NUCLEO-G431KB
- (in symbol X-NUCLEO-ArduinoShield) Module

## Library data of the parts
3v3To3v3Nuc P5V Pbuz Pvccmot Pvccvin = JUMPER2: BARRETTE 2 CONTACTS 1 RANGEE MALE DROITE; Type: JUMPER2
+5Vp UART2 VCC = BARRETTE3: Header, 3-Pin; LatestRevisionDate: 17-Jul-2002; LatestRevisionNote: Re-released for DXP Platform.; Publisher: Altium Limited
? = MCP23S17-E/SO: I/O Expander 16 SPI 10MHz 28-SOIC; MF: Microchip; MP: MCP23S17-E/SO; SnapEDA_Link: https://www.snapeda.com/parts/MCP23S17-E/SO/Microchip/view-part/48911/?ref=snap; Value: *; Package: SOIC-28 Microchip; Price: None; Availability: Unavailable
ANx DHT11_data In1 MAX4466_out MCP9701 = Point Test: Publisher: Damien GUITTON
B0-B4 = BOUTON_POUSSOIR_MINIATURE_TRAVERSANT: BOUTON POUSSOIR MINIATURE TRAVERSANT ON/OFF; Type: B_POUSS_MINI_T
BZ1 = BUZZER_SMA13_OR_TMB12A: BUZZER SMA13
CB0-CB4 Cdt Cft = CONDENSATEUR_CER_RAD_5.08: Type: RADIAL_5.08
Cd_tft = CONDENSATEUR_CMS_CER_0805: CONDENSATEUR CMS CERAMIQUE 0805; Value: 10µF; Type: Cd_tft
CdGE CdUand = : CONDENSATEUR_CER_CMS_0805; Type: RADIAL_5.08
Cdtsop Cin Cout1 = CONDENSATEUR_POL_ELECTROLY_RAD_2.0/5.08: CONDENSATEUR POLARISE ELECTROLYTIQUE RADIAL 2.0/5.08; Type: POL_RAD_2.0/5.08
CdWS = CONDENSATEUR_POL_ELECTROLY_RAD_5.08/10.16: CONDENSATEUR POLARISE ELECTROLYTIQUE RADIAL 5.08/10.16; Type: POL_RAD_5.08/10.16
Cf1 = CONDENSATEUR_CER_RAD_5.08: Value: 100nF; Type: RADIAL_5.08
CL1 = CLAVIER_16_TOUCHES: CLAVIER 16 TOUCHES
Cmot0 Cmot1 = CONDENSATEUR_CMS_CER_1206: CONDENSATEUR CMS CERAMIQUE 1206; Type: CMS_1206
CNY70 = BARRETTE_2 CONTACTS_2 RANGEES_FEMELLE_DROITE
Cout2 = CONDENSATEUR_CER_RAD_5.08: CONDENSATEUR TRAVERSANT CERAMIQUE RADIAL 5.08mm
Cout4 = CONDENSATEUR_POL_ELECTROLY_RAD_2.54/5.08: CONDENSATEUR POLARISE ELECTROLYTIQUE RADIAL 2.54/5.08
D D0 = LED_3MM: LED 3MM - ROUGE/VERTE/JAUNE
  D0: Type: LED_3mm
G341 = G431_Nucleo: The STM32 Nucleo-32 board provides an affordable and flexible way for users to try out new concepts and build prototypes by choosing from the various combinations of performance and power consumption features, provided by the STM32 microcontroller.
HC-05 = BARRETTE_6 CONTACTS_1 RANGEE_FEMELLE_DROITE: BARRETTE 6 CONTACTS 1 RANGEE FEMELLE DROITE
J_5Vp J_GND J_VCC = DOUILLE_BANANE_4mm: DOUILLE BANANE 4 mm
  J_5Vp: Type: BANANE_4mm
J_analogSensor = BARRETTE_3 CONTACTS_1 RANGEE_FEMELLE_DROITE
J_BT = EMBASE_BASSE_TENSION_2.1mm: EMBASE BASSE TENSION 2.1mm
Jcharge0 Jcharge2 JchargeP0 Jinput1 MOT0 MOT1 = BORNIER2_DROIT_A VIS: BORNIER 2 PLOTS DROIT A VIS 5.08mm
  Jcharge2 Jinput1: Type: BORNIER2_D
Joystick = BARRETTE_5 CONTACTS_1 RANGEE_MALE_DROITE: BARRETTE 5 CONTACTS 1 RANGEE MALE DROITE
MatLED = BORNIER3_DROIT_A VIS: BORNIER 3 PLOTS DROIT A VIS 5.08mm
MISO=PA6 MOSI=PA7 PA9_TX PA10_RX SCK=PA5 SDgnd0-SDgnd3 = Goutte Strap: Goutte Strap_2; LatestRevisionDate: 30/01/11; Publisher: Damien Guitton
PT0 = RESISTANCE_VARIABLE_TRAVERSANTE : PT10LV: RESISTANCE VARIABLE_TRAVERSANTE : PT10LV
QIR QnMOS0 = TRANSISTOR_MOSFET-N_SOT23_GSD: TRANSISTOR MOSFET CANAL N BOITIER SOT23_GSD
  QIR: Package: SOT23
QnMOS2 = TRANSISTOR_MOSFET-N_TO220_GDS: TRANSISTOR MOSFET CANAL N BOITIER TO220_GDS
QpMOS = TRANSISTOR_MOSFET-P_SOT23_GSD: TRANSISTOR MOSFET CANAL P BOITIER SOT23_GSD
R+tsop Rkpu0-Rkpu7 RLed0 RpdIR RpuB0-RpuB4 RpuSCL RpuSDA Rputsop RsIR RsSMA RsWS = RESISTANCE_CMS_1206: RESISTANCE CMS 1206
  R+tsop Rkpu0-Rkpu7 RpdIR RpuSCL RpuSDA Rputsop RsIR RsSMA RsWS: Type: CMS_1206
Recho+ Recho- Rft RpdLDR RpuDHT11 = Resistor: Published: 8-Jun-2000; LatestRevisionDate: 17-Jul-2002; LatestRevisionNote: Re-released for DXP Platform.; PackageReference: AXIAL-0.5; Publisher: Altium Limited
Rpd1 Rpu1 RpuJoy RpuRst Rs1 = RESISTANCE_CMS_1206: RESISTANCE CMS 1206; Value: 10k; Type: CMS_1206
RpuCNY RsCNY = RESISTANCE_CMS_1206: Type: CMS_1206
RpullMos0 RpullMos2 RpullMosP = RESISTANCE_AXIALE_1/4W: RESISTANCE TRAVERSANTE AXIALE 1/4W; Type: 1/4W
Servo0 Servo1 = BARRETTE_3 CONTACTS_1 RANGEE_MALE_DROITE
TSOP38238 = RECEPTEUR_INFRAROUGE_TSOP38238_38kHz: Type: TSOP38238
U3V3 U5V = REGULATEUR_TO220_78XX: REGULATEUR DE TENSION POSITIVE 78XX BOITIER TO220
Uand = SN74AHCT1G08DBVR: Single 2-Input Positive-AND Gate, DBV0005A, LARGE T&R; Manufacturer: Texas Instruments; VCC(Min)(V): 2; VCC(Max)(V): 5.5; Output Type: CMOS; ICC @ Nom Voltage(Max)(mA): 0.01; Bits(#): 1; F @ Nom Voltage(Max)(Mhz): 75; Rating: Catalog; Technology Family: AHCT; Voltage(Nom)(V): 5; Schmitt Trigger: No; Output Drive (IOL/IOH)(Max)(mA): 8/-8; tpd @ Nom Voltage(Max)(ns): 7.1; Logic: True; Gate Type: AND; DatasheetVersion: SCLS315P; PackageReference: DBV0005A; Supplier 1: Mouser; Supplier Part Number 1: 595-SN74AHCT1G08DBVR; Supplier 2: Digi-Key; Supplier Part Number 2: 296-1113-2-ND; Supplier 3: Digi-Key; Supplier Part Number 3: 296-1113-1-ND; Supplier 4: Digi-Key; Supplier Part Number 4: 296-1113-6-ND; Generic Part Number: SN74AHCT1G08; Input Type: CMOS; Operating Temperature Range(C): -40 to 125; Sub-Family: AND Gate; 3-State Output: No; PartNumber: SN74AHCT1G08DBVR; ComponentLink1Description: Manufacturer URL; ComponentLink1URL: http://www.ti.com/; ComponentLink2Description: Datasheet; ComponentLink2URL: http://www.ti.com/lit/ds/symlink/sn74ahct1g08.pdf
Umot0 Umot1 = BD6220F: H Bridge - 2A
Utemp = CAPTEUR_TEMPERATURE_MCP9701-E/TO: CAPTEUR DE TEMPERATURE ANALOGIQUE LINEAIRE - TO92